# Altium schematic sheet overview.SchDoc
size 381 x 241 mm
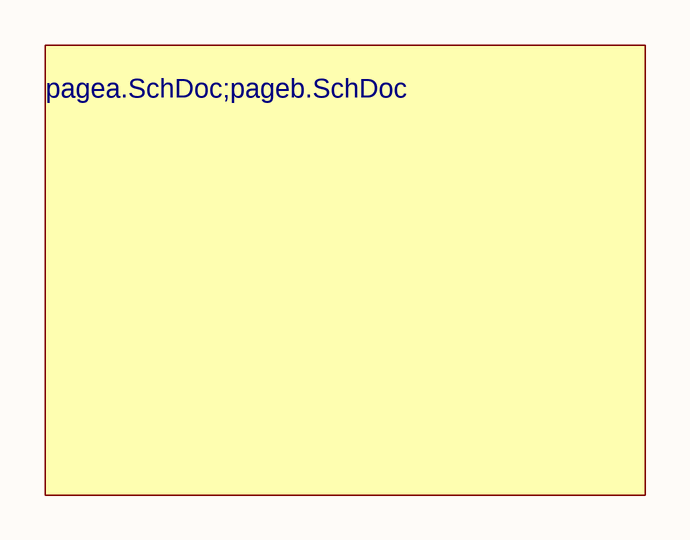
[diagram p0: overview.SchDoc]

## Sub-sheets
? = pagea.SchDoc;pageb.SchDoc: no entries